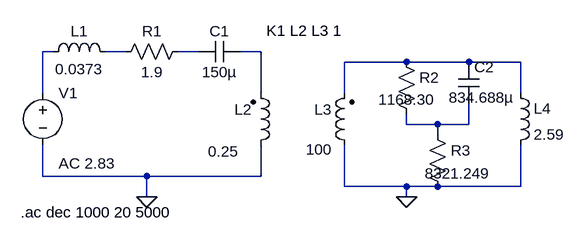
[diagram p0: schematic EA_EX7_PistaoBaffleInfinito.asc]
EA_EX7_PistaoBaffleInfinito.asc, the LTspice schematic file:
Version 4
SHEET 1 880 680
WIRE -64 80 -80 80
WIRE 48 80 16 80
WIRE 160 80 128 80
WIRE 256 80 224 80
WIRE 480 96 384 96
WIRE 576 96 480 96
WIRE 656 96 576 96
WIRE -80 144 -80 80
WIRE 256 144 256 80
WIRE 384 144 384 96
WIRE 656 144 656 96
WIRE 480 192 480 176
WIRE 528 192 480 192
WIRE 576 192 576 160
WIRE 576 192 528 192
WIRE 528 208 528 192
WIRE -80 272 -80 224
WIRE 80 272 -80 272
WIRE 256 272 256 224
WIRE 256 272 80 272
WIRE 384 288 384 224
WIRE 480 288 384 288
WIRE 528 288 480 288
WIRE 656 288 656 224
WIRE 656 288 528 288
WIRE 80 304 80 272
WIRE 480 304 480 288
FLAG 480 304 0
FLAG 80 304 0
SYMBOL voltage -80 128 R0
WINDOW 123 24 124 Left 2
WINDOW 39 0 0 Left 0
SYMATTR InstName V1
SYMATTR Value ""
SYMATTR Value2 AC 2.83
SYMBOL ind -80 96 R270
WINDOW 0 32 56 VTop 2
WINDOW 3 5 56 VBottom 2
SYMATTR InstName L1
SYMATTR Value 0.0373
SYMBOL res 144 64 R90
WINDOW 0 0 56 VBottom 2
WINDOW 3 32 56 VTop 2
SYMATTR InstName R1
SYMATTR Value 1.9
SYMBOL cap 224 64 R90
WINDOW 0 0 32 VBottom 2
WINDOW 3 32 32 VTop 2
SYMATTR InstName C1
SYMATTR Value 150µ
SYMBOL ind2 240 240 M180
WINDOW 0 -25 71 Left 2
WINDOW 3 -66 6 Left 2
SYMATTR InstName L2
SYMATTR Value 0.25
SYMBOL ind2 400 240 R180
WINDOW 0 35 71 Left 2
WINDOW 3 34 9 Left 2
SYMATTR InstName L3
SYMATTR Value 100
SYMBOL res 464 80 R0
WINDOW 3 -27 74 Left 2
SYMATTR InstName R2
SYMATTR Value 1168.30
SYMBOL res 512 192 R0
WINDOW 3 -4 76 Left 2
SYMATTR InstName R3
SYMATTR Value 8321.249
SYMBOL cap 560 96 R0
WINDOW 3 -15 55 Left 2
SYMATTR InstName C2
SYMATTR Value 834.688µ
SYMBOL ind 640 128 R0
SYMATTR InstName L4
SYMATTR Value 2.59
TEXT 264 48 Left 2 !K1 L2 L3 1
TEXT -114 328 Left 2 !.ac dec 1000 20 5000

The netlist it stands for:
* EA_EX7_PistaoBaffleInfinito.asc
V1 N001 0 AC 2.83
L1 N001 N002 0.0373
R1 N003 N002 1.9
C1 N004 N003 150µ
L2 0 N004 0.25
L3 0 N005 100
R2 N005 N006 1168.30
R3 N006 0 8321.249
C2 N005 N006 834.688µ
L4 N005 0 2.59
K1 L2 L3 1
.ac dec 1000 20 5000
.backanno
.end